# EasyEDA Pro project ProPrj_BLDC_complete_drive_controller_REV2_2026-06-24.epro

# Schematic Schematic1
Board Name: Board1; Create Date: 2026-06-22; Page Name: P1; Project Name: BLDC_complete_drive_controller_REV2; Schematic Name: Schematic1; Update Date: 2026-06-22; Company: EasyEDA.com; Page Size: A4; Version: V1.0
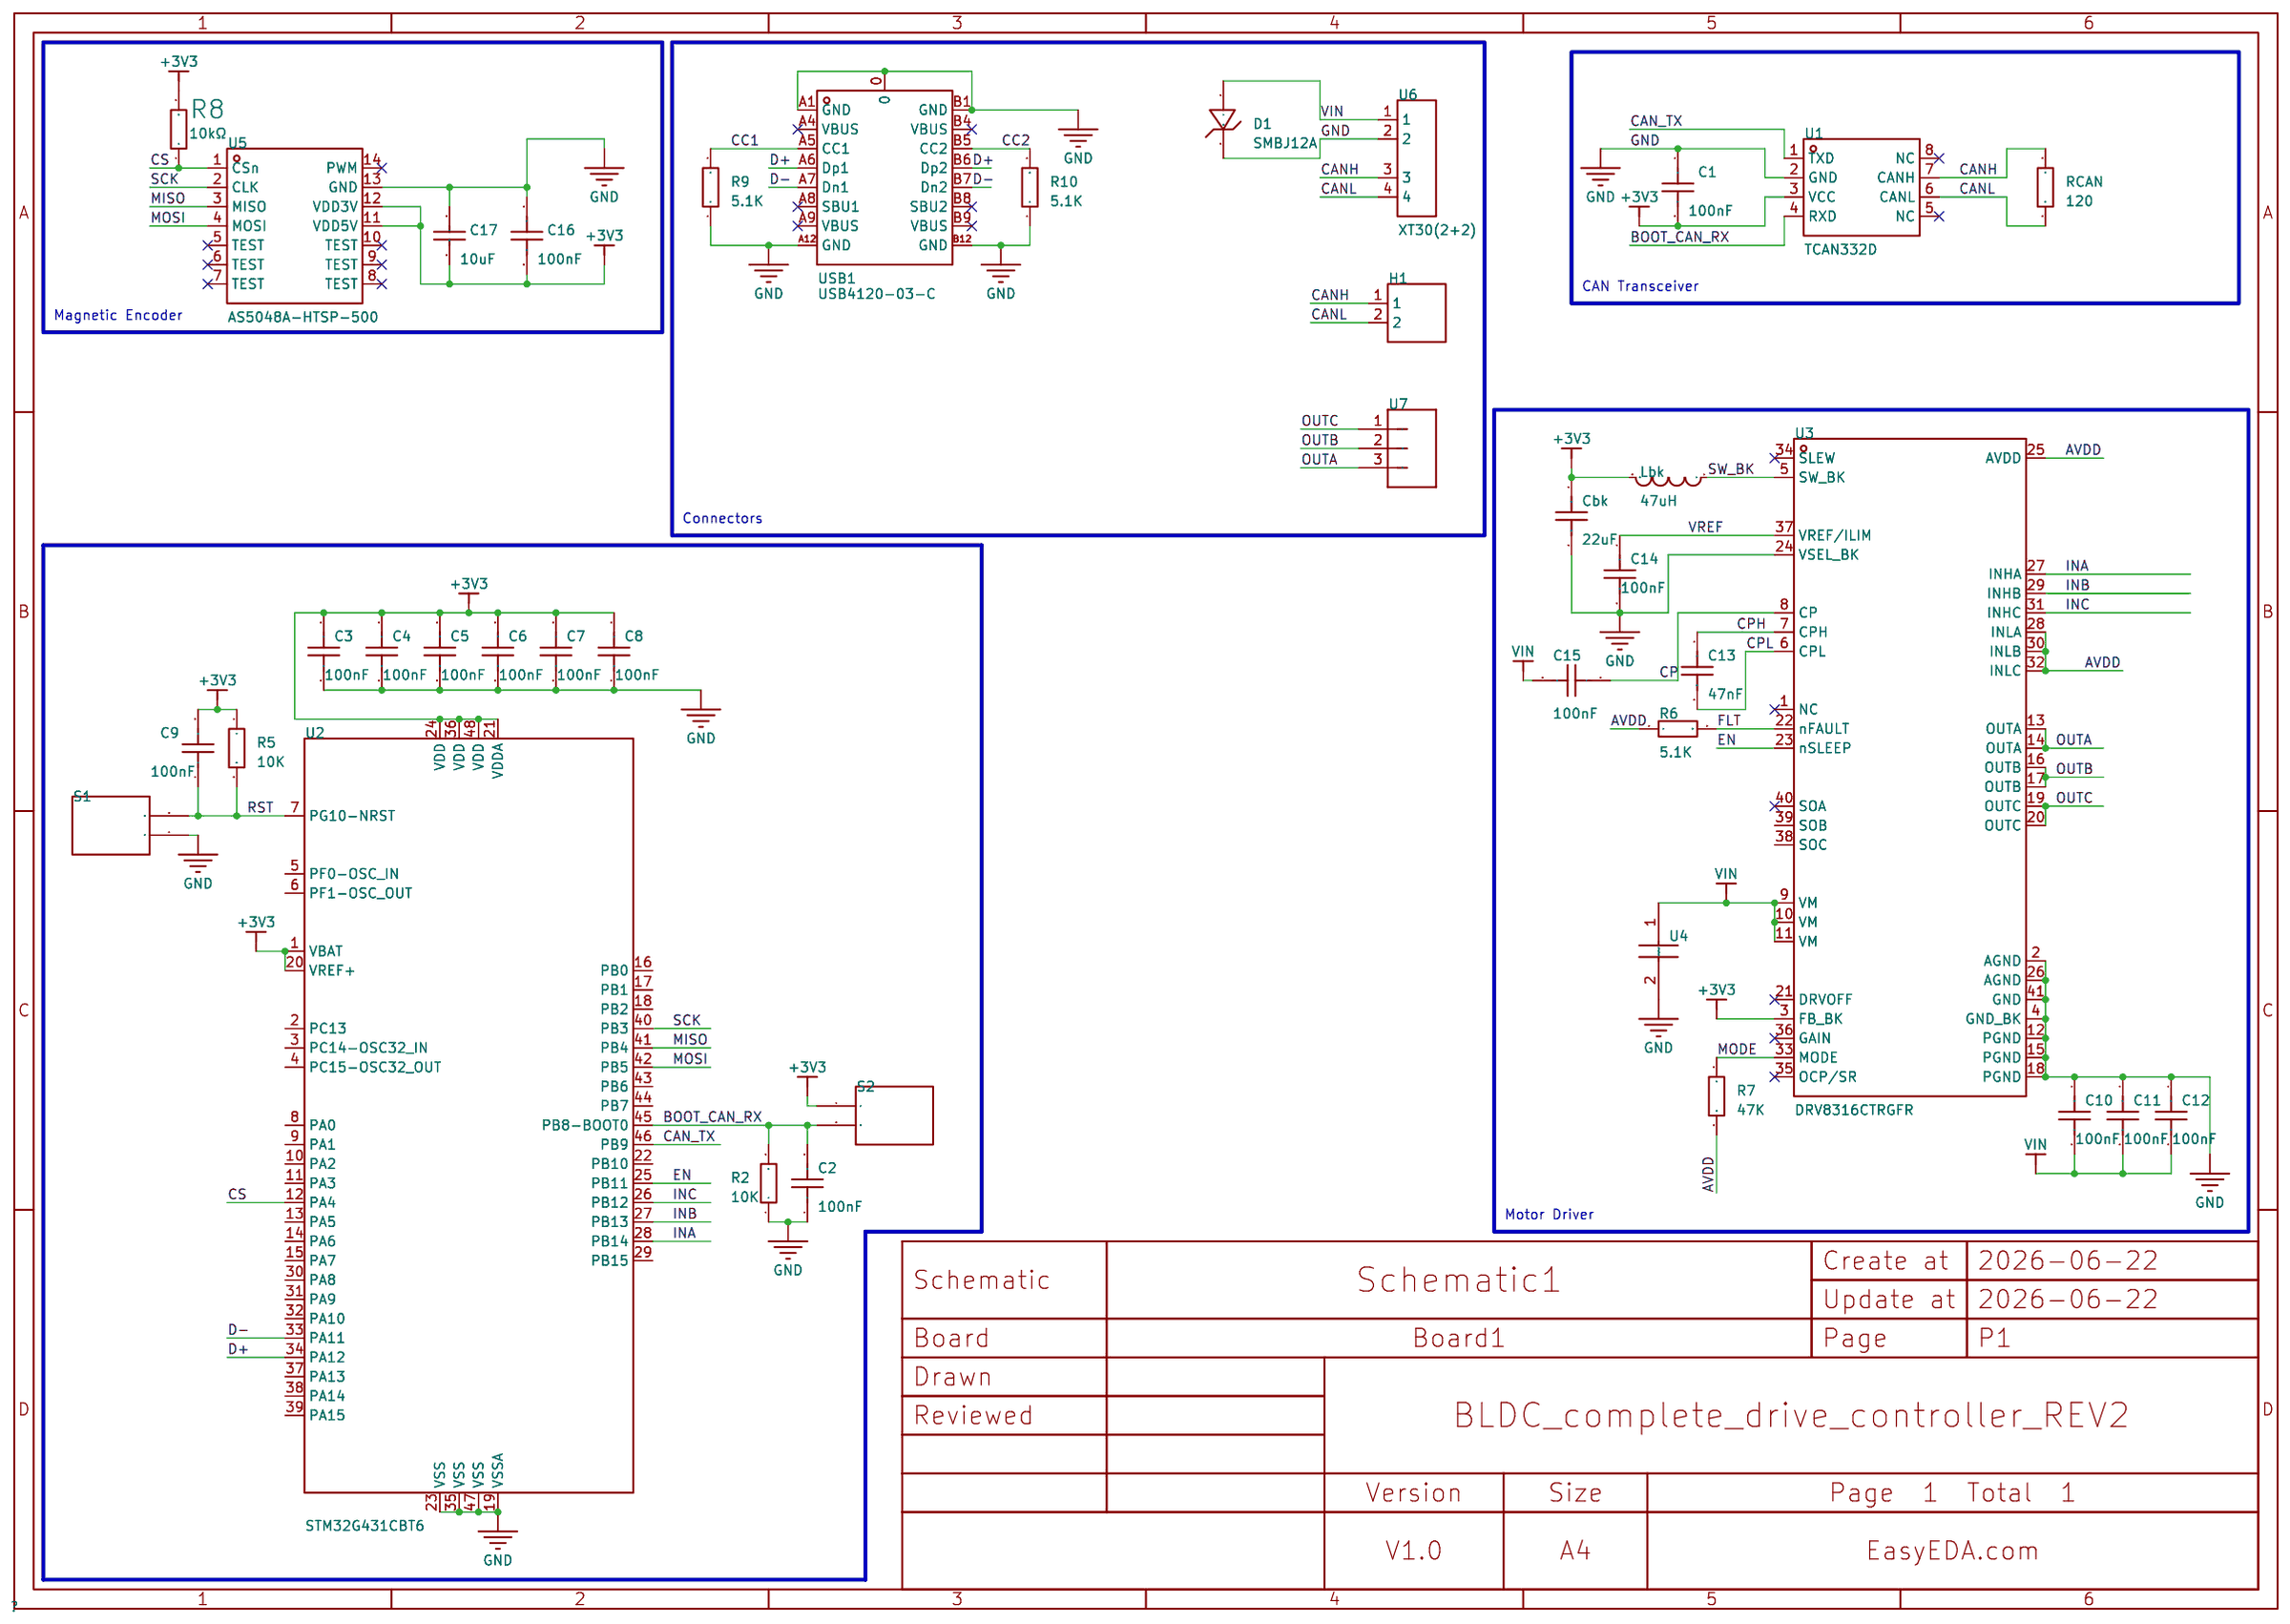
[diagram p0: schematic sheet]

## Parts
C1  100nF  [C0402]
C2  100nF  [C0402]
C3  100nF  [C0402]
C4  100nF  [C0402]
C5  100nF  [C0402]
C6  100nF  [C0402]
C7  100nF  [C0402]
C8  100nF  [C0402]
C9  100nF  [C0402]
C10  100nF  [C0603]
C11  100nF  [C0603]
C12  100nF  [C0603]
C13  47nF  [C0603]
C14  100nF  [C0402]
C15  100nF  [C0603]
C16  100nF  [C0603]
C17  10uF  [C0402]
Cbk  22uF  [C0402]
D1  SMBJ12A  [SMB_L4.6-W3.6-LS5.3-RD]
H1  -  [HDR-TH_2P-P2.54-V-M-1]
Lbk  47uH  [L0805]
R2  10K  [R0603]
R5  10K  [R0603]
R6  5.1K  [R0402]
R7  47K  [R0402]
R8  10kΩ  [R0603]
R9  5.1K  [R0603]
R10  5.1K  [R0603]
RCAN  120  [R0603]
S1  -  [95C04A3GWRT]
S2  -  [95C04A3GWRT]
U1  TCAN332D  [SOIC-8_L4.9-W3.9-P1.27-LS6.0-BL]
U2  STM32G431CBT6  [LQFP-48_L7.0-W7.0-P0.50-LS9.0-BL]
U3  DRV8316CTRGFR  [VQFN-40_L7.0-W5.0-P0.50-TL-EP5.7]
U4  aha0608470m035r  [CAPAE660X850N]
U5  AS5048A-HTSP-500  [TSSOP-14_L5.0-W4.4-P0.65-LS6.4-BL]
U6  XT30(2+2)  [CONN-TH_XT30-2-2]
U7  -  [SCREWTERMINAL-3.5MM-3]
USB1  USB4120-03-C  [TYPE-C-SMD_USB4120-03-C]

## Library data of the parts
C1-C9 C14 Cbk = CAP_0402: Supplier Part: C1525; Supplier Footprint: 0402
C10-C13 C15 = CAP_0603: Supplier Footprint: 0603
C16 = CC0603KRX7R9BB104: Capacitance:100nF Tolerance:±10% Tolerance:±10% Voltage Rating:50V Temperature Coefficient:X7R; LCSC Part Name: 100nF ±10% 50V; Supplier Part: C14663; Manufacturer: YAGEO(国巨); Supplier Footprint: 0603; JLCPCB Part Class: Basic Part; Datasheet: https://item.szlcsc.com/datasheet/CC0603KRX7R9BB104/15331.html; Supplier: LCSC; Tolerance: ±10%; Voltage Rating: 50V; Temperature Coefficient: X7R
C17 = CL05A106MQ5NUNC: Capacitance:10uF Tolerance:±20% Tolerance:±20% Voltage Rating:6.3V Temperature Coefficient:X5R; LCSC Part Name: 10uF ±20% 6.3V; Supplier Part: C15525; Manufacturer: SAMSUNG(三星); Supplier Footprint: 0402; JLCPCB Part Class: Basic Part; Datasheet: https://item.szlcsc.com/datasheet/CL05A106MQ5NUNC/16204.html; Supplier: LCSC; Tolerance: ±20%; Voltage Rating: 6.3V; Temperature Coefficient: X5R
D1 = SMBJ12A: Reverse Stand-Off Voltage (Vrwm):12V Maximum Clamping Voltage:19.9V Peak Pulse Current (Ipp)@10/1000us:30.2A Breakdown Voltage:13.3V Type:TVS; Supplier Part: C127552; Supplier Footprint: SMB(DO-214AA); JLCPCB Part Class: Extended Part; Datasheet: https://atta.szlcsc.com/upload/public/pdf/source/20190828/C415856_91585ADD1001807004044059320FFAFB.pdf; Supplier: LCSC; Reverse Stand-Off Voltage (Vrwm): 12V; Maximum Clamping Voltage: 19.9V; Peak Pulse Current (Ipp)@10/1000us: 30.2A; Breakdown Voltage: 13.3V; Type: TVS
H1 = HDR-M_2.54_1x2P: Supplier Footprint: Through
Lbk = L_0805
R2 R5 R9 R10 RCAN = Res_0603: Supplier Footprint: 0603
R6 R7 = Res_0402: Supplier Footprint: 0402
R8 = 0603WAF1002T5E: Type:Thick Film Resistor Resistance:10kΩ Tolerance:±1% Tolerance:±1% Power(Watts):100mW Voltage-Supply(Max):75V Temperature Coefficient:±100ppm/℃ Temperature Coefficient:±100ppm/℃ Operating Temperature:-55℃~+155℃ Operating Temperature:-55℃~+155℃; LCSC Part Name: 厚膜电阻 10kΩ ±1% 100mW; Supplier Part: C25804; Manufacturer: UNI-ROYAL(厚声); Supplier Footprint: 0603; JLCPCB Part Class: Basic Part; Datasheet: https://item.szlcsc.com/datasheet/0603WAF1002T5E/26547.html; Supplier: LCSC; Type: Thick Film Resistor; Tolerance: ±1%; Power(Watts): 100mW; Voltage-Supply(Max): 75V; Temperature Coefficient: ±100ppm/℃; Operating Temperature: -55℃~+155℃
S1 S2 = 95c04a3gwrt
U1 = TCAN332D: Type:Transceiver Data Rate:1Mbps Supply Voltage:3V~3.6V Supply Voltage:3V~3.6V Operating Temperature:-40℃~+125℃ Operating Temperature:-40℃~+125℃; Supplier Part: C1544505; Manufacturer: TI(德州仪器); Supplier Footprint: SOIC-8; JLCPCB Part Class: Extended Part; Datasheet: https://www.ti.com/cn/lit/gpn/tcan332; Supplier: LCSC; Type: Transceiver; Data Rate: 1Mbps; Supply Voltage: 3V~3.6V; Operating Temperature: -40℃~+125℃
U2 = STM32G431CBT6: CPU Core:ARM Cortex-M Series CPU Maximum Speed:170MHz Program Storage Size:128KB Program Memory Type:FLASH Number of I/O:38 ADC (Bit):12bit DAC (Bit):12bit Voltage - Supply:1.71V~3.6V Voltage - Supply:1.71V~3.6V Applications:-; LCSC Part Name: 带DSP和FPU的170MHz主流ARM Cortex-M4 MCU，具有128 KB Flash存储器、数学加速器和中等模拟电平集成; Supplier Part: C529355; Manufacturer: ST(意法半导体); Supplier Footprint: LQFP-48(7x7); JLCPCB Part Class: Extended Part; Datasheet: https://item.szlcsc.com/datasheet/STM32G431CBT6/549633.html; Supplier: LCSC; CPU Core: ARM Cortex-M Series; CPU Maximum Speed: 170MHz; Program Storage Size: 128KB; Program Memory Type: FLASH; Number of I/O: 38; ADC (Bit): 12bit; DAC (Bit): 12bit; Voltage - Supply: 1.71V~3.6V
U3 = DRV8316CTRGFR: Output Current:8A Output Current:8A Peak Current:8A Voltage - Supply:- Voltage - Supply:- RDS(on):95mΩ Operating Temperature:-40℃~+125℃ Operating Temperature:-40℃~+125℃; LCSC Part Name: DRV8316C 三相集成FET电机驱动器; Supplier Part: C6602057; Manufacturer: TI(德州仪器); Supplier Footprint: VQFN-40(5x7); Datasheet: https://item.szlcsc.com/datasheet/DRV8316CTRGFR/7556994.html; Supplier: LCSC; Output Current: 8A; Peak Current: 8A; RDS(on): 95mΩ; Operating Temperature: -40℃~+125℃
U4 = aha0608470m035r
U5 = AS5048A-HTSP-500: Voltage - Supply:3V~3.6V；4.5V~5.5V Voltage - Supply:3V~3.6V；4.5V~5.5V Rotation Angle:0°~360° Rotation Angle:0°~360°; Supplier Part: C2655181; Manufacturer: ams(艾迈斯半导体); Supplier Footprint: TSSOP-14; JLCPCB Part Class: Extended Part; Datasheet: https://item.szlcsc.com/datasheet/AS5048A-HTSP-500/2747090.html; Supplier: LCSC; Voltage - Supply: 3V~3.6V；4.5V~5.5V; Rotation Angle: 0°~360°
U6 = XT30(2+2): Supplier Part: C9900178769; Supplier Footprint: 插件; Supplier: LCSC
U7 = CONN_03_POS_SCREW_3.5MM
USB1 = USB4120-03-C: Connector Type:Type-C Protocol Standard:USB 2.0 Gender:Female Number of Contacts:24P Number of Ports:1 Current Rating-Power:5A Voltage Rating:48V Detection color:Black Operating Temperature:-25℃~+85℃ Operating Temperature:-25℃~+85℃; LCSC Part Name: Type-C 母; Supplier Part: C3445864; Manufacturer: GCT; Supplier Footprint: SMD; JLCPCB Part Class: Extended Part; Datasheet: https://item.szlcsc.com/datasheet/USB4120-03-C/4011241.html; Supplier: LCSC; Connector Type: Type-C; Protocol Standard: USB 2.0; Gender: Female; Number of Contacts: 24P; Number of Ports: 1; Current Rating-Power: 5A; Voltage Rating: 48V; Detection color: Black; Operating Temperature: -25℃~+85℃

## Nets
+3V3: C1.2 C3.2 C4.2 C5.2 C6.2 C7.2 C8.2 C9.2 C16.2 C17.1 Cbk.1 Lbk.2 R5.1 R8.2 S2.1 U1.3(VCC) U2.1(VBAT) U2.20(VREF+) U2.21(VDDA) U2.24(VDD) U2.36(VDD) U2.48(VDD) U3.3(FB_BK) U5.11(VDD5V) U5.12(VDD3V)
AVDD: R6.1 R7.2 U3.25(AVDD) U3.28(INLA) U3.30(INLB) U3.32(INLC)
GND: C1.1 C2.1 C3.1 C4.1 C5.1 C6.1 C7.1 C8.1 C10.1 C11.1 C12.1 C14.2 C16.1 C17.2 Cbk.2 D1.1(C) R2.1 R9.1 R10.1 S1.1 U1.2(GND) U2.19(VSSA) U2.23(VSS) U2.35(VSS) U2.47(VSS) U3.2(AGND) U3.4(GND_BK) U3.12(PGND) U3.15(PGND) U3.18(PGND) U3.24(VSEL_BK) U3.26(AGND) U3.41(GND) U4.2 U5.13(GND) U6.2 USB1.0 USB1.A1(GND) USB1.A12(GND) USB1.B1(GND) USB1.B12(GND)
VIN: C10.2 C11.2 C12.2 C15.2 D1.2(A) U3.9(VM) U3.10(VM) U3.11(VM) U4.1 U6.1
BOOT_CAN_RX: C2.2 R2.2 S2.2 U1.4(RXD) U2.45(PB8-BOOT0)
CAN_TX: U1.1(TXD) U2.46(PB9)
CANH: H1.1 RCAN.2 U1.7(CANH) U6.3
CANL: H1.2 RCAN.1 U1.6(CANL) U6.4
CC1: R9.2 USB1.A5(CC1)
CC2: R10.2 USB1.B5(CC2)
CP: C15.1 U3.8(CP)
CPH: C13.1 U3.7(CPH)
CPL: C13.2 U3.6(CPL)
CS: R8.1 U2.12(PA4) U5.1(CSn)
D+: U2.34(PA12) USB1.A6(Dp1) USB1.B6(Dp2)
D-: U2.33(PA11) USB1.A7(Dn1) USB1.B7(Dn2)
EN: U2.25(PB11) U3.23(nSLEEP)
FLT: R6.2 U3.22(nFAULT)
INA: U2.28(PB14) U3.27(INHA)
INB: U2.27(PB13) U3.29(INHB)
INC: U2.26(PB12) U3.31(INHC)
MISO: U2.41(PB4) U5.3(MISO)
MODE: R7.1 U3.33(MODE)
MOSI: U2.42(PB5) U5.4(MOSI)
OUTA: U3.13(OUTA) U3.14(OUTA) U7.3
OUTB: U3.16(OUTB) U3.17(OUTB) U7.2
OUTC: U3.19(OUTC) U3.20(OUTC) U7.1
RST: C9.1 R5.2 S1.2 U2.7(PG10-NRST)
SCK: U2.40(PB3) U5.2(CLK)
SW_BK: Lbk.1 U3.5(SW_BK)
VREF: C14.1 U3.37(VREF/ILIM)

Not connected (* = marked no-connect by the designer): U1 5(NC)* 8(NC)*; U2 2(PC13) 3(PC14-OSC32_IN) 4(PC15-OSC32_OUT) 5(PF0-OSC_IN) 6(PF1-OSC_OUT) 8(PA0) 9(PA1) 10(PA2) 11(PA3) 13(PA5) 14(PA6) 15(PA7) 16(PB0) 17(PB1) 18(PB2) 22(PB10) 29(PB15) 30(PA8) 31(PA9) 32(PA10) 37(PA13) 38(PA14) 39(PA15) 43(PB6) 44(PB7); U3 1(NC)* 21(DRVOFF)* 34(SLEW)* 35(OCP/SR)* 36(GAIN)* 38(SOC) 39(SOB) 40(SOA)*; U5 5(TEST)* 6(TEST)* 7(TEST)* 8(TEST)* 9(TEST)* 10(TEST)* 14(PWM)*; USB1 A4(VBUS)* A8(SBU1)* A9(VBUS)* B4(VBUS)* B8(SBU2)* B9(VBUS)*

## Notes on the sheet
- CAN Transceiver
- Magnetic Encoder
- Connectors
- Motor Driver

# Board PCB1
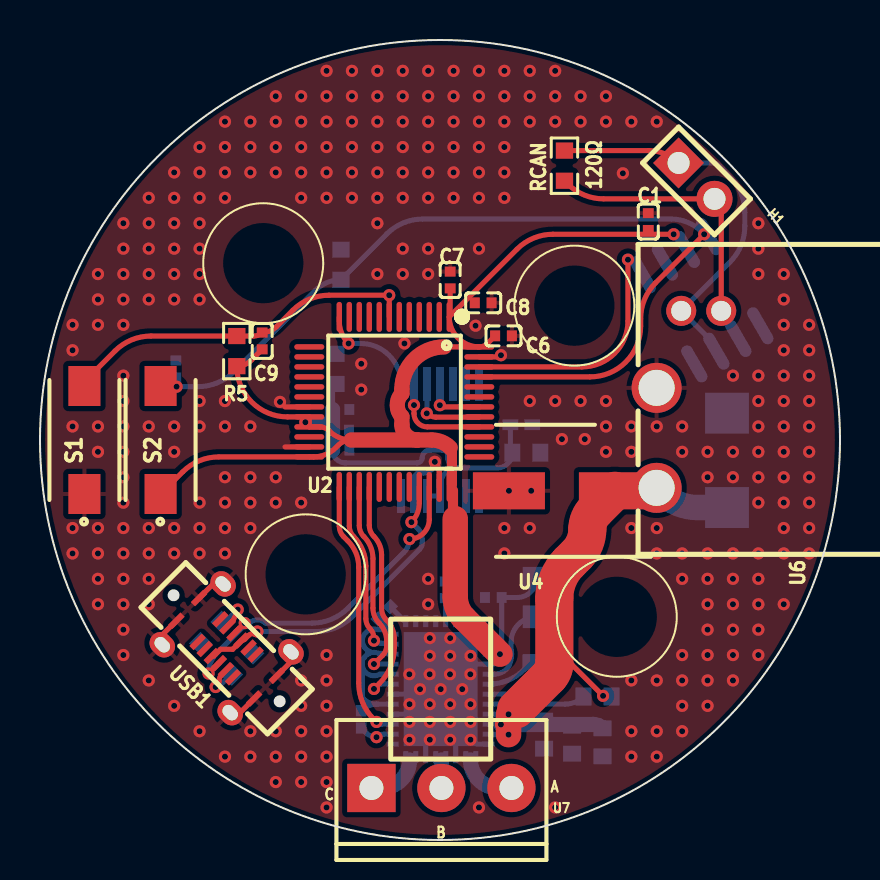
[diagram p1: board, top side]
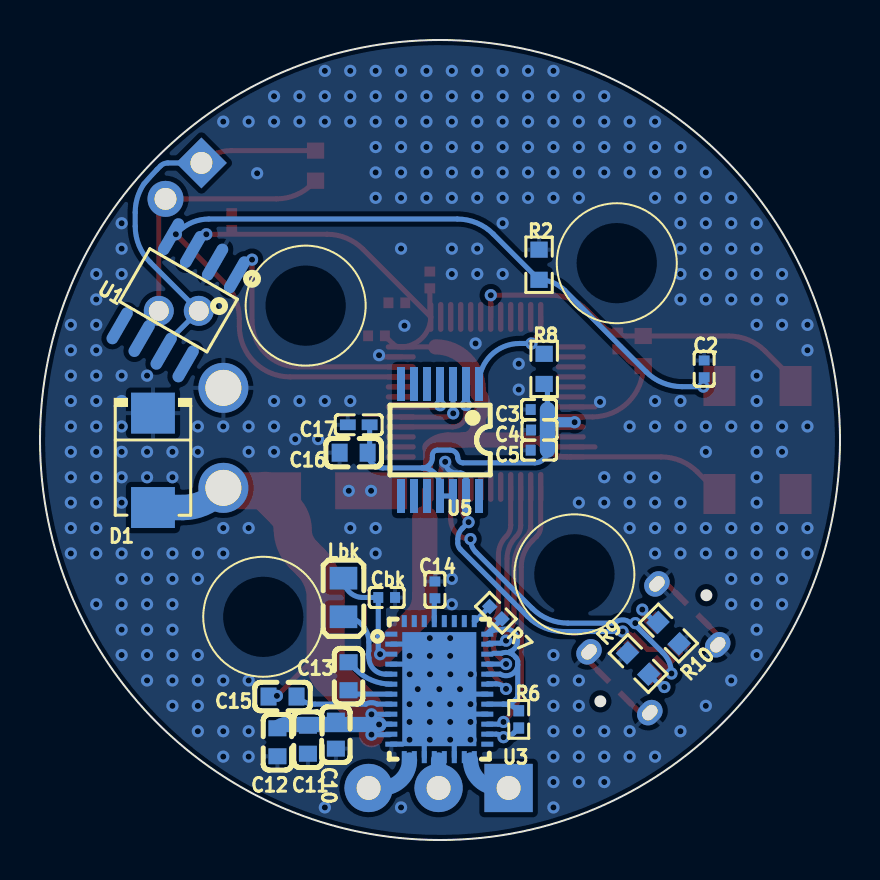
[diagram p2: board, bottom side, seen from below]

Outline 40 x 40 mm; copper layers: Top Layer, Bottom Layer. Coordinates in mm from the lower left corner of the outline.
Outline path: circle c20,20 r20
Stack: Top Layer 0.035mm / Dielectric1 1.51mm FR4 er 4.5 / Bottom Layer 0.035mm

## Design rules (mm)
spacing copperThickness1oz (default): track to track 0.102, other pairs 0.152 to 0.3
spacing copperThickness2oz: track to track 0.203, other pairs 0.152 to 0.3
track width copperThickness1oz (default): min 0.127, default 0.254, max 2.54
track width copperThickness2oz: min 0.203, default 0.254, max 2.54
differential pair differentialPair (default): width min 0.127, default 0.254, max 2.54; gap min 0.152, default 0.152
net GND uses copperRegion

## Placement (name value [footprint] x y rotation side)
C1  100nF  [C0402]  30.41 30.92 270 top
C2  100nF  [C0402]  6.79 23.56 270 bottom
C3  100nF  [C0402]  15.05 21.52 180 bottom
C4  100nF  [C0402]  15.03 20.5 180 bottom
C5  100nF  [C0402]  15.05 19.49 180 bottom
C6  100nF  [C0402]  23.18 25.21 180 top
C7  100nF  [C0402]  20.51 28 270 top
C8  100nF  [C0402]  22.16 26.86 180 top
C9  100nF  [C0402]  11.11 24.95 270 top
C10  100nF  [C0603]  25.21 5.27 90 bottom
C11  100nF  [C0603]  26.6 5.01 90 bottom
C12  100nF  [C0603]  28.13 4.89 90 bottom
C13  47nF  [C0603]  24.57 8.19 90 bottom
C14  100nF  [C0402]  20.25 12.51 90 bottom
C15  100nF  [C0603]  27.87 7.17 0 bottom
C16  100nF  [C0603]  24.32 19.36 180 bottom
C17  10uF  [C0402#2]  24.06 20.76 0 bottom
Cbk  22uF  [C0402]  22.67 12.13 180 bottom
D1  SMBJ12A  [SMB_L4.6-W3.6-LS5.3-RD]  34.35 18.98 270 bottom
H1  -  [HDR-TH_2P-P2.54-V-M-1]  32.83 32.95 315 top
Lbk  47uH  [L0805]  24.83 12.13 90 bottom
R2  10K  [R0603]  15.05 28.76 270 bottom
R5  10K  [R0603]  9.84 24.44 90 top
R6  5.1K  [R0402]  16.06 6.03 270 bottom
R7  47K  [R0402]  17.21 11.36 225 bottom
R8  10kΩ  [R0603]  14.79 23.56 270 bottom
R9  5.1K  [R0603]  10.09 8.82 225 bottom
R10  5.1K  [R0603]  8.57 10.35 45 bottom
RCAN  120  [R0603]  26.22 33.72 90 top
S1  -  [95C04A3GWRT]  2.22 20 90 top
S2  -  [95C04A3GWRT]  6.03 20 90 top
U1  TCAN332D  [SOIC-8_L4.9-W3.9-P1.27-LS6.0-BL]  33.08 26.98 30 bottom
U2  STM32G431CBT6  [LQFP-48_L7.0-W7.0-P0.50-LS9.0-BL]  17.71 21.91 180 top
U3  DRV8316CTRGFR  [VQFN-40_L7.0-W5.0-P0.50-TL-EP5.7]  20.04 7.54 180 bottom
U4  aha0608470m035r  [CAPAE660X850N]  26.1 17.46 180 top
U5  AS5048A-HTSP-500  [TSSOP-14_L5.0-W4.4-P0.65-LS6.4-BL]  20 20 0 bottom
U6  XT30(2+2)  [CONN-TH_XT30-2-2]  32.45 22.03 90 top
U7  -  [SCREWTERMINAL-3.5MM-3]  16.57 2.6 0 top
USB1  USB4120-03-C  [TYPE-C-SMD_USB4120-03-C]  9.33 9.59 135 top

## Footprints (pads in the part's own frame, mm; a bottom-side part is the same pattern mirrored in y, then rotated)
95C04A3GWRT
  rect 2x1.6 smd: 1(-2.7,0) 2(2.7,0)
C0402
  rect 0.5x0.54 smd: 1(-0.42,0) 2(0.42,0)
C0402#2
  rect 0.79x0.54 smd: 1(-0.545,0) 2(0.545,0)
C0603
  rect 0.8x0.9 smd: 1(-0.7,0) 2(0.7,0)
CAPAE660X850N
  rect 3.6x1.85 smd: 1(-2.65,0) 2(2.65,0)
CONN-TH_XT30-2-2
  round 2.5 hole 1.8: 1(-4.425,1.615) 2(0.575,1.615)
  round 1.5 hole 1: 3(4.425,0.385) 4(4.425,-1.615)
HDR-TH_2P-P2.54-V-M-1
  rect 1.8x1.8 hole 1.1: 1(-1.27,0)
  round 1.8 hole 1.1: 2(1.27,0)
L0805
  rect 1.133x1.377 smd: 1(-0.966,0) 2(0.966,0)
LQFP-48_L7.0-W7.0-P0.50-LS9.0-BL
  oval 0.27x1.5 smd: 1(-2.75,-4.25) 2(-2.25,-4.25) 3(-1.75,-4.25) 4(-1.25,-4.25) 5(-0.75,-4.25) 6(-0.25,-4.25) 7(0.25,-4.25) 8(0.75,-4.25) 9(1.25,-4.25) 10(1.75,-4.25) 11(2.25,-4.25) 12(2.75,-4.25) 25(2.75,4.25) 26(2.25,4.25) 27(1.75,4.25) 28(1.25,4.25) 29(0.75,4.25) 30(0.25,4.25) 31(-0.25,4.25) 32(-0.75,4.25) 33(-1.25,4.25) 34(-1.75,4.25) 35(-2.25,4.25) 36(-2.75,4.25)
  oval 1.5x0.27 smd: 13(4.25,-2.75) 14(4.25,-2.25) 15(4.25,-1.75) 16(4.25,-1.25) 17(4.25,-0.75) 18(4.25,-0.25) 19(4.25,0.25) 20(4.25,0.75) 21(4.25,1.25) 22(4.25,1.75) 23(4.25,2.25) 24(4.25,2.75) 37(-4.25,2.75) 38(-4.25,2.25) 39(-4.25,1.75) 40(-4.25,1.25) 41(-4.25,0.75) 42(-4.25,0.25) 43(-4.25,-0.25) 44(-4.25,-0.75) 45(-4.25,-1.25) 46(-4.25,-1.75) 47(-4.25,-2.25) 48(-4.25,-2.75)
R0402
  rect 0.566x0.54 smd: 1(-0.433,0) 2(0.433,0)
R0603
  rect 0.806x0.864 smd: 1(-0.753,0) 2(0.753,0)
SCREWTERMINAL-3.5MM-3
  rect 2.413x2.413 hole 1.2: 1(0,0)
  round 2.413 hole 1.2: 2(3.5,0) 3(7,0)
SMB_L4.6-W3.6-LS5.3-RD
  rect 2.047x2.192 smd: 1(-2.361,0) 2(2.361,0)
SOIC-8_L4.9-W3.9-P1.27-LS6.0-BL
  oval 0.588x2.045 smd: 1(-1.905,-2.57) 2(-0.635,-2.57) 3(0.635,-2.57) 4(1.905,-2.57) 5(1.905,2.57) 6(0.635,2.57) 7(-0.635,2.57) 8(-1.905,2.57)
TSSOP-14_L5.0-W4.4-P0.65-LS6.4-BL
  rect 0.4x1.7 smd: 1(-1.95,-2.8) 2(-1.3,-2.8) 3(-0.65,-2.8) 4(0,-2.8) 5(0.65,-2.8) 6(1.3,-2.8) 7(1.95,-2.8) 8(1.95,2.8) 9(1.3,2.8) 10(0.65,2.8) 11(0,2.8) 12(-0.65,2.8) 13(-1.3,2.8) 14(-1.95,2.8)
TYPE-C-SMD_USB4120-03-C
  oval 1.35x1.1 hole 0.85x0.6: 0(-2.4,2.15) 0(-2.4,-2.15) 0(2.4,2.15) 0(2.4,-2.15)
  rect 0.3x0.87 smd: A1(-2.75,0.8) A4(-1.25,0.8) A5(-0.75,0.8) A6(-0.25,0.8) A7(0.25,0.8) A8(0.75,0.8) A9(1.25,0.8) A12(2.75,0.8) B1(2.75,-0.8) B4(1.25,-0.8) B5(0.75,-0.8) B6(0.25,-0.8) B7(-0.25,-0.8) B8(-0.75,-0.8) B9(-1.25,-0.8) B12(-2.75,-0.8)
VQFN-40_L7.0-W5.0-P0.50-TL-EP5.7
  rect 0.6x0.25 smd: 1(-2.4,2.75) 2(-2.4,2.25) 3(-2.4,1.75) 4(-2.4,1.25) 5(-2.4,0.75) 6(-2.4,0.25) 7(-2.4,-0.25) 8(-2.4,-0.75) 9(-2.4,-1.25) 10(-2.4,-1.75) 11(-2.4,-2.25) 12(-2.4,-2.75) 21(2.4,-2.75) 22(2.4,-2.25) 23(2.4,-1.75) 24(2.4,-1.25) 25(2.4,-0.75) 26(2.4,-0.25) 27(2.4,0.25) 28(2.4,0.75) 29(2.4,1.25) 30(2.4,1.75) 31(2.4,2.25) 32(2.4,2.75)
  rect 0.25x0.6 smd: 13(-1.75,-3.4) 14(-1.25,-3.4) 15(-0.75,-3.4) 16(-0.25,-3.4) 17(0.25,-3.4) 18(0.75,-3.4) 19(1.25,-3.4) 20(1.75,-3.4) 33(1.75,3.4) 34(1.25,3.4) 35(0.75,3.4) 36(0.25,3.4) 37(-0.25,3.4) 38(-0.75,3.4) 39(-1.25,3.4) 40(-1.75,3.4)
  rect 3.7x5.7 smd: 41(0,0)

## Nets
As in the schematic.

Pads without a net: U1 5 8; U2 2 3 4 5 6 8 9 10 11 13 14 15 16 17 18 22 29 30 31 32 37 38 39 43 44; U3 1 21 34 35 36 38 39 40; U5 5 6 7 8 9 10 14; USB1 A4 A8 A9 B4 B8 B9

## Via types
v1: diameter 0.61, hole 0.305, Top Layer to Bottom Layer, 331 vias

## Routing (per net, layer and track width the routed paths; a pad name or vN(x,y) marks a point on that pad's centre or on a via; arc(x,y) is an arc through that point)
+3V3: length 86.2
  Top Layer w0.254: C9.2 10.57,24 arc(10.24,23.77) R5.1 arc(10.58,21.9) 12.38,21.16 U2.20 U2.21 13.98,20.66 arc(14.24,20.6) 14.46,20.45 arc(14.97,20.12) 15.56,20 arc(15.2,19.93) 14.9,19.73 14.79,19.62 arc(14.28,19.28) 13.67,19.16 U2.24 8.94,19.16 arc(7.97,18.96) 7.14,18.41 S2.1 ; U2.1 23.85,29.54 arc(24.68,30.09) 25.65,30.29 v1(31.68,30.29) ; U2.1 arc(20.9,25.09) U2.48 ; U2.1 arc(20.5,26.2) 20.51,26.26 C7.2 ; C6.2 22.37,24.82 arc(22.18,24.7) U2.48 ; U2.48 20.21,24.66
  Top Layer w0.508: 20.6,17.79 20.6,19.38 20.46,19.51 arc(20.48,19.57) 20.51,19.62 ; 20.65,17.47 20.65,16.26
  Top Layer w0.762: 18.86,20 15.56,20 ; 18.86,20 19.59,20 arc(20.09,19.9) 20.51,19.62 ; 18.86,20 arc(18.32,20.22) 18.09,20.76 18.09,21.17 arc(17.86,21.75) 18.09,22.33 18.09,22.54 arc(18.71,24.04) 20.21,24.66
  Top Layer w1.27: 20.76,16.06 20.76,12.16 arc(20.88,11.57) 21.21,11.08 v1(23,9.29)
  Bottom Layer w0.254: C3.2 14.63,22.4 arc(14.67,22.62) R8.2 ; U5.12 U5.11 20,17.71 arc(20.26,18.34) 20.89,18.6 ; 20.89,18.6 22.86,18.6 arc(23.39,18.83) C16.2 arc(23.55,19.39) 23.52,19.46 C17.1 ; 20.89,18.6 arc(20.53,18.75) 20.38,19.11 20.38,19.24 arc(20.31,19.42) 20.13,19.49 19.49,19.49 arc(19.22,19.38) 19.11,19.11 arc(19.04,18.93) 18.86,18.86 15.26,18.86 arc(14.81,19.04) C5.2 ; v1(23,9.29) arc(23.06,9.32) 23.09,9.38 Cbk.1 23.86,12.13 arc(24.54,12.41) Lbk.2
  Bottom Layer w0.508: v1(13.27,20.89) 14.22,20.89 arc(14.49,20.77) C4.2
  Bottom Layer w0.762: C5.2 C3.2
AVDD: length 11.5
  Bottom Layer w0.254: 17.33,9.33 16.93,9.33 arc(16.7,9.38) 16.46,9.33 arc(16.42,9.32) 16.39,9.3 ; U3.28 16.99,8.29 arc(16.42,8.29) 16.11,8.77 ; 16.39,9.3 16.37,9.28 arc(16.28,9.21) 16.22,9.13 16.19,9.1 arc(16.13,9.02) 16.11,8.92 16.11,8.77 ; 16.39,9.3 16.5,9.42 arc(16.15,10.16) 16.89,10.52 17.09,10.52 arc(17.39,10.46) U3.32 arc(17.63,10.32) 17.61,10.34 R7.2 ; 16.86,6.79 U3.25 ; 16.86,6.79 16.8,6.79 arc(16.47,6.86) 16.19,7.05 arc(16.13,7.13) 16.11,7.23 16.11,8.77 ; 16.86,6.79 arc(16.43,6.71) R6.1
GND: length 17.1
  Top Layer w0.254: USB1.A12 6.11,10.26 6.11,9.76 ; USB1.0 8.66,12.8 7.95,12.1 ; U2.23 12.25,19.66 ; 12.55,9.41 12.55,8.91 USB1.B12 ; U2.35 19.96,18.37 arc(19.91,18.66) v1(19.74,18.91) ; USB1.0 10,6.37 10.71,7.08 ; U2.47 22.84,24.16 arc(22.95,24.18) v1(23.05,24.24) ; U2.19 12.25,21.66
  Bottom Layer w0.254: U3.4 21.88,8.79 ; U3.15 20.79,4.7 ; U3.18 19.29,4.7 ; U3.26 18.19,7.29 ; U3.24 18.19,6.29 ; U3.2 21.88,9.79 ; U5.13 18.7,18.06 arc(18.78,18.27) 18.98,18.35 19.18,18.35 arc(19.58,18.51) v1(19.74,18.91) ; U3.12 21.88,4.79
  vias: v1(1.63,25.76) v1(1.63,24.49) v1(1.63,20.68) v1(1.63,15.6) v1(1.63,14.33) v1(2.9,28.3) v1(2.9,27.03) v1(2.9,25.76) v1(2.9,20.68) v1(2.9,19.41) v1(2.9,15.6) v1(2.9,14.33) v1(2.9,13.06) v1(2.9,11.79) v1(4.17,30.84) v1(4.17,29.57) v1(4.17,28.3) v1(4.17,27.03) v1(4.17,25.76) v1(4.17,23.22) v1(4.17,21.95) v1(4.17,20.68) v1(4.17,19.41) v1(4.17,18.14) v1(4.17,16.87) v1(4.17,15.6) v1(4.17,14.33) v1(4.17,13.06) v1(4.17,11.79) v1(4.17,10.52) v1(4.17,9.25) v1(5.44,32.11) v1(5.44,30.84) v1(5.44,29.57) v1(5.44,28.3) v1(5.44,27.03) v1(5.44,20.68) v1(5.44,15.6) v1(5.44,14.33) v1(5.44,13.06) v1(5.44,11.79) v1(5.44,7.98) v1(6.71,33.38) v1(6.71,32.11) v1(6.71,30.84) v1(6.71,29.57) v1(6.71,28.3) v1(6.71,27.03) v1(6.71,20.68) v1(6.71,19.41) v1(6.71,15.6) v1(6.71,14.33) v1(6.71,6.71) v1(7.98,34.65) v1(7.98,33.38) v1(7.98,32.11) v1(7.98,30.84) v1(7.98,29.57) v1(7.98,28.3) v1(7.98,27.03) v1(7.98,21.95) v1(7.98,20.68) v1(7.98,16.87) v1(7.98,15.6) v1(7.98,14.33) v1(7.98,5.44) v1(9.25,35.92) v1(9.25,34.65) v1(9.25,33.38) v1(9.25,32.11) v1(9.25,21.95) v1(9.25,20.68) v1(9.25,18.14) v1(9.25,16.87) v1(9.25,15.6) v1(9.25,14.33) v1(9.25,4.17) v1(10.52,35.92) v1(10.52,34.65) v1(10.52,33.38) v1(10.52,20.68) v1(10.52,18.14) v1(10.52,16.87) v1(10.52,15.6) v1(10.52,5.44) v1(10.52,4.17) v1(11.79,37.19) v1(11.79,35.92) v1(11.79,34.65) v1(11.79,33.38) v1(11.79,18.14) v1(11.79,16.87) v1(11.79,5.44) v1(11.79,4.17) v1(11.79,2.9) v1(12,21.91) v1(13.06,37.19) v1(13.06,35.92) v1(13.06,34.65) v1(13.06,33.38) v1(13.06,32.11) v1(13.06,16.87) v1(13.06,7.98) v1(13.06,6.71) v1(13.06,5.44) v1(13.06,4.17) v1(13.06,2.9) v1(14.33,38.46) v1(14.33,37.19) v1(14.33,35.92) v1(14.33,34.65) v1(14.33,33.38) v1(14.33,32.11) v1(14.33,9.25) v1(14.33,7.98) v1(14.33,6.71) v1(14.33,5.44) v1(14.33,4.17) v1(14.33,2.9) v1(14.33,1.63) v1(15.6,38.46) v1(15.6,37.19) v1(15.6,35.92) v1(15.6,34.65) v1(15.6,33.38) v1(15.6,32.11) v1(16.06,23.81) v1(16.06,22.52) v1(16.87,38.46) v1(16.87,37.19) v1(16.87,35.92) v1(16.87,34.65) v1(16.87,33.38) v1(16.87,32.11) v1(16.87,30.84) v1(16.87,28.3) v1(18.14,38.46) v1(18.14,37.19) v1(18.14,35.92) v1(18.14,34.65) v1(18.14,33.38) v1(18.14,32.11) v1(18.14,29.57) v1(18.14,28.3) v1(18.22,24.83) v1(18.47,8.29) v1(18.48,6.79) v1(18.48,5.9) v1(18.48,5.01) v1(19,7.54) v1(19.41,38.46) v1(19.41,37.19) v1(19.41,35.92) v1(19.41,34.65) v1(19.41,33.38) v1(19.41,32.11) v1(19.41,29.57) v1(19.41,28.3) v1(19.41,13.06) v1(19.41,11.79) v1(19.49,10.09) v1(19.49,9.2) v1(19.48,8.29) v1(19.49,6.79) v1(19.49,5.9) v1(19.49,5.01) v1(20.04,7.54) v1(20.51,10.09) v1(20.51,9.2) v1(20.5,8.29) v1(20.51,6.79) v1(20.51,5.9) v1(20.51,5.01) v1(20.68,38.46) v1(20.68,37.19) v1(20.68,35.92) v1(20.68,34.65) v1(20.68,33.38) v1(20.68,32.11) v1(21.11,7.54) v1(21.52,9.2) v1(21.52,8.29) v1(21.52,6.79) v1(21.52,5.9) v1(21.52,5.01) v1(21.78,25.72) v1(21.95,38.46) v1(21.95,37.19) v1(21.95,35.92) v1(21.95,34.65) v1(21.95,33.38) v1(21.95,32.11) v1(21.95,29.57) v1(21.95,1.63) v1(23.22,38.46) v1(23.22,37.19) v1(23.22,35.92) v1(23.22,34.65) v1(23.22,33.38) v1(23.22,32.11) v1(23.22,15.6) v1(23.22,14.33) v1(23.45,17.46) v1(24.49,38.46) v1(24.49,37.19) v1(24.49,35.92) v1(24.49,21.95) v1(24.49,15.6) v1(24.56,17.46) v1(25.76,38.46) v1(25.76,37.19) v1(25.76,35.92) v1(25.76,21.95) v1(25.76,1.63) v1(26.1,20.04) v1(27.03,37.19) v1(27.03,35.92) v1(27.03,21.95) v1(27.24,20.04) v1(28.3,37.19) v1(28.3,35.92) v1(28.3,21.95) v1(28.3,20.68) v1(28.3,19.41) v1(29.14,33.33) v1(29.57,35.92) v1(29.57,20.68) v1(29.57,19.41) v1(29.57,15.6) v1(29.57,7.98) v1(29.57,5.44) v1(29.57,4.17) v1(30.84,35.92) v1(30.84,20.68) v1(30.84,15.6) v1(30.84,14.33) v1(30.84,7.98) v1(30.84,5.44) v1(30.84,4.17) v1(32.11,20.68) v1(32.11,19.41) v1(32.11,14.33) v1(32.11,13.06) v1(32.11,9.25) v1(32.11,7.98) v1(32.11,6.71) v1(32.11,5.44) v1(33.38,19.41) v1(33.38,18.14) v1(33.38,14.33) v1(33.38,13.06) v1(33.38,11.79) v1(33.38,10.52) v1(33.38,9.25) v1(33.38,7.98) v1(33.38,6.71) v1(34.65,23.22) v1(34.65,19.41) v1(34.65,18.14) v1(34.65,14.33) v1(34.65,13.06) v1(34.65,11.79) v1(34.65,10.52) v1(34.65,9.25) v1(34.65,7.98) v1(35.92,30.84) v1(35.92,29.57) v1(35.92,28.3) v1(35.92,23.22) v1(35.92,21.95) v1(35.92,20.68) v1(35.92,19.41) v1(35.92,18.14) v1(35.92,16.87) v1(35.92,14.33) v1(35.92,13.06) v1(35.92,11.79) v1(35.92,10.52) v1(35.92,9.25) v1(37.19,28.3) v1(37.19,27.03) v1(37.19,25.76) v1(37.19,24.49) v1(37.19,23.22) v1(37.19,21.95) v1(37.19,20.68) v1(37.19,19.41) v1(37.19,18.14) v1(37.19,16.87) v1(37.19,15.6) v1(37.19,14.33) v1(37.19,11.79) v1(38.46,25.76) v1(38.46,24.49) v1(38.46,23.22) v1(38.46,21.95) v1(38.46,20.68) v1(38.46,19.41) v1(38.46,18.14) v1(38.46,16.87) v1(38.46,15.6) v1(38.46,14.33)
VIN: length 28.7
  Top Layer w0.254: v1(28.15,7.21) 26.62,8.74 arc(26.23,9.32) 26.1,10.01
  Top Layer w1.27: v1(23.43,5.27) v1(23.43,6.28)
  Top Layer w1.905: U4.1 27.75,16.46 arc(27.47,16.04) 27.37,15.54 arc(27.23,14.85) 26.84,14.27 26.46,13.89 arc(25.91,13.06) 25.72,12.09 25.72,8.82 arc(25.64,8.47) 25.45,8.17 23.81,6.54
  Bottom Layer w0.254: v1(23.43,5.27) 22.5,5.27 ; v1(23.43,6.28) 22.51,6.28 ; U3.10 23.01,5.79 arc(23.03,5.79) v1(23.05,5.78)
  Bottom Layer w0.762: v1(23.05,5.78) 27.67,5.78 arc(27.92,5.73) C12.2
  Bottom Layer w1.27: U6.1 31.07,17.37 arc(31.89,16.82) 32.87,16.62 D1.2
BOOT_CAN_RX: length 45.1
  Top Layer w0.254: v1(33.21,30.29) 30.78,27.86 arc(30.23,27.03) 30.03,26.06 30.03,25.69 arc(29.29,23.9) 27.49,23.16 U2.45
  Bottom Layer w0.254: v1(33.21,30.29) 33.07,30.42 arc(32.38,30.89) 31.56,31.05 19.14,31.05 arc(18.17,30.86) 17.34,30.31 R2.2 arc(14.35,27.87) 13.76,27.48 9.69,23.41 arc(8.87,22.86) 7.9,22.67 v1(6.83,22.67)
CAN_TX: length 11.8
  Top Layer w0.254: U2.46 27.1,23.66 arc(28.73,24.33) 29.4,25.95 v1(29.4,29.02)
CANH: length 19.6
  Top Layer w0.254: RCAN.2 30.44,34.47 arc(31.25,34.31) H1.1
  Bottom Layer w0.254: U1.7 33.82,24.7 U6.3 34.5,28.89 arc(35.05,29.72) 35.24,30.69 35.24,31.38 arc(35.13,32.13) 34.8,32.8 arc(34.48,33.17) 34.15,33.52 33.97,33.7 arc(33.81,33.81) 33.61,33.85 H1.1
CANL: length 13.5
  Top Layer w0.254: U6.4 34.06,31.24 arc(33.97,31.68) 33.72,32.06 28.18,32.06 arc(27.21,32.25) 26.39,32.8 RCAN.1
CC1: length 2.1
  Top Layer w0.254: USB1.A5 9.1,8.29 arc(8.99,8.13) 8.95,7.94 arc(8.93,7.83) 8.87,7.74 v1(8.78,7.65)
  Bottom Layer w0.254: R9.2 9.02,7.75 arc(8.91,7.68) v1(8.78,7.65)
CC2: length 2.1
  Top Layer w0.254: v1(9.89,11.52) 9.89,11.31 arc(9.75,11.17) 9.67,10.98 USB1.B5
  Bottom Layer w0.254: v1(9.89,11.52) 9.35,10.98 arc(9.24,10.91) R10.2
CP: length 4.9
  Bottom Layer w0.254: U3.8 23.14,6.79 arc(23.43,6.87) 23.71,6.79 26.25,6.79 arc(26.75,6.89) C15.1
CPH: length 2.2
  Bottom Layer w0.254: U3.7 24.38,7.29 arc(24.51,7.35) C13.1
CPL: length 2.5
  Bottom Layer w0.254: C13.2 24.21,8.53 arc(23.4,7.98) U3.6
CS: length 5.2
  Top Layer w0.254: U2.12 14.96,25.95 arc(15.08,25.34) v1(15.43,24.83)
  Bottom Layer w0.254: v1(15.43,24.83) 16.02,24.83 arc(17.46,24.23) U5.1
D+: length 18
  Top Layer w0.254: U2.34 19.46,16.03 arc(19.17,15.34) v1(18.48,15.05) ; v1(8.43,8.33) 8.94,8.84 USB1.A6 ; 9.72,10.33 v1(10.24,10.84)
  Bottom Layer w0.254: v1(18.48,15.05) arc(18.41,14.69) 18.21,14.4 15.4,11.59 arc(14.57,11.04) 13.6,10.84 11.28,10.84 arc(10.87,11.01) 10.47,10.84 v1(10.24,10.84) arc(10.22,10.75) 10.17,10.67 8.86,9.37 arc(8.54,8.89) v1(8.43,8.33)
D-: length 15.9
  Top Layer w0.254: U2.33 18.96,16.84 arc(18.86,16.33) v1(18.57,15.89) ; v1(10.87,10.42) 10.74,10.29 arc(10.58,10.31) 10.43,10.23 10.25,10.05 arc(10.17,9.99) 10.07,9.97 9.64,9.54 9.03,9.54 8.69,9.2 8.59,9.2
  Bottom Layer w0.254: v1(18.57,15.89) 18.89,15.57 arc(19.05,15.33) 19.11,15.05 19.11,14.85 arc(19.08,14.68) 18.98,14.54 15.61,11.17 arc(14.79,10.62) 13.82,10.42 v1(10.87,10.42)
EN: length 13.1
  Top Layer w0.254: v1(16.82,5.9) 16.68,6.05 arc(16.13,6.87) 15.94,7.84 15.94,13.65 arc(15.8,14.35) 15.4,14.95 15.17,15.17 arc(15.02,15.41) 14.96,15.68 U2.25
  Bottom Layer w0.254: U3.23 17.09,5.79 arc(16.95,5.82) v1(16.82,5.9)
FLT: length 1.8
  Bottom Layer w0.254: U3.22 17.19,5.29 arc(16.99,5.25) v1(16.82,5.14) arc(16.54,5.2) 16.3,5.36 R6.2
INA: length 11.8
  Top Layer w0.254: v1(16.7,7.55) 16.97,7.83 arc(17.52,8.65) 17.71,9.62 17.71,10.06 arc(17.61,10.56) 17.33,10.98 arc(17.15,11.26) 17.08,11.6 17.08,14.25 arc(16.98,14.75) 16.7,15.17 arc(16.52,15.43) 16.46,15.74 U2.28
  Bottom Layer w0.254: v1(16.7,7.55) 16.77,7.63 arc(16.97,7.76) 17.21,7.81 17.6,7.81 arc(17.62,7.8) U3.27
INB: length 10.4
  Top Layer w0.254: U2.27 15.96,15.72 arc(16.02,15.42) 16.19,15.17 arc(16.53,14.67) 16.65,14.07 16.65,11.59 arc(16.73,11.19) 16.95,10.86 arc(17.23,10.43) 17.33,9.94 17.33,9.71 arc(17.28,9.45) 17.13,9.23 v1(16.7,8.8)
  Bottom Layer w0.254: v1(16.7,8.8) 17.62,8.8 arc(17.63,8.8) U3.29
INC: length 9
  Top Layer w0.254: v1(16.7,9.97) 16.7,10.08 arc(16.65,10.35) 16.5,10.57 arc(16.34,10.8) 16.29,11.06 16.29,13.7 arc(16.13,14.5) 15.68,15.17 arc(15.52,15.42) 15.46,15.7 U2.26
  Bottom Layer w0.254: v1(16.7,9.97) arc(16.84,9.87) 17,9.84 17.52,9.84 arc(17.58,9.83) U3.31
MISO: length 4.1
  Top Layer w0.254: v1(19.34,21.33) arc(19.55,21.19) 19.79,21.14 21.94,21.14 arc(21.95,21.15) U2.41
  Bottom Layer w0.254: U5.3 19.35,21.36 arc(19.35,21.34) v1(19.34,21.33)
MODE: length 1.1
  Bottom Layer w0.254: R7.1 18.21,10.97 arc(18.24,10.95) U3.33
MOSI: length 2
  Top Layer w0.254: U2.42 20.2,21.66 arc(20.09,21.68) v1(19.99,21.74)
OUTA: length 2.8
  Bottom Layer w0.762: U7.3 22.92,2.6 arc(21.93,3.01) 21.52,4
OUTB: length 1.4
  Bottom Layer w0.762: U7.2 20.07,4
OUTC: length 2.7
  Bottom Layer w0.762: U7.1 17.08,2.6 arc(18.07,3.01) 18.48,4
RST: length 16.9
  Top Layer w0.254: U2.7 17.46,27.23 arc(17.46,27.24) v1(17.46,27.24) 14.45,27.24 arc(13.48,27.05) 12.65,26.5 11.83,25.67 arc(11.5,25.45) C9.1 arc(10.92,25.24) 10.69,25.2 R5.2 5.55,25.2 arc(4.58,25.01) 3.75,24.45 2.85,23.56
SCK: length 4.1
  Top Layer w0.254: v1(18.7,21.75) 18.7,21.32 arc(18.89,20.85) 19.37,20.66 U2.40
SW_BK: length 4.4
  Bottom Layer w0.254: U3.5 22.72,8.29 arc(23.31,8.54) 23.56,9.12 arc(23.58,9.29) 23.56,9.46 23.56,9.89 arc(23.93,10.79) Lbk.1
VREF: length 1.2
  Bottom Layer w0.254: U3.37 20.29,12.01 arc(20.28,12.05) C14.1

## Copper pours and planes (outline as drawn; the poured copper is in the pictures)
GND on Top Layer: 42.3,20.45 42.26,21.36 42.19,22.26 42.08,23.16 41.93,24.05 41.74,24.94 41.52,25.82 41.26,26.69 40.97,27.55 40.64,28.39 40.27,29.22 39.87,30.03 39.44,30.83 38.98,31.61 38.48,32.37 37.96,33.11 37.4,33.82 36.81,34.51 36.2,35.18 35.56,35.82 34.89,36.43 34.2,37.02 33.49,37.58 32.75,38.1 31.99,38.6 31.21,39.06 30.41,39.49 29.6,39.89 28.77,40.26 27.93,40.58 27.07,40.88 26.2,41.14 25.32,41.36 24.44,41.55 23.54,41.69 22.64,41.81 21.74,41.88 20.83,41.92 19.93,41.92 19.02,41.88 18.12,41.81 17.22,41.69 16.33,41.55 15.44,41.36 14.56,41.14 13.69,40.88 12.84,40.58 11.99,40.26 11.16,39.89 10.35,39.49 9.55,39.06 8.77,38.6 8.01,38.1 7.28,37.58 6.56,37.02 5.87,36.43 5.2,35.82 4.56,35.18 3.95,34.51 3.36,33.82 2.81,33.11 2.28,32.37 1.78,31.61 1.32,30.83 0.89,30.03 0.49,29.22 0.13,28.39 -0.2,27.55 -0.5,26.69 -0.76,25.82 -0.98,24.94 -1.16,24.05 -1.31,23.16 -1.43,22.26 -1.5,21.36 -1.54,20.45 -1.54,19.55 -1.5,18.64 -1.43,17.74 -1.31,16.84 -1.16,15.95 -0.98,15.06 -0.76,14.18 -0.5,13.31 -0.2,12.45 0.13,11.61 0.49,10.78 0.89,9.97 1.32,9.17 1.78,8.39 2.28,7.63 2.81,6.89 3.36,6.18 3.95,5.49 4.56,4.82 5.2,4.18 5.87,3.57 6.56,2.98 7.28,2.42 8.01,1.9 8.77,1.4 9.55,0.94 10.35,0.51 11.16,0.11 11.99,-0.26 12.84,-0.58 13.69,-0.88 14.56,-1.14 15.44,-1.36 16.33,-1.55 17.22,-1.69 18.12,-1.81 19.02,-1.88 19.93,-1.92 20.83,-1.92 21.74,-1.88 22.64,-1.81 23.54,-1.69 24.44,-1.55 25.32,-1.36 26.2,-1.14 27.07,-0.88 27.93,-0.58 28.77,-0.26 29.6,0.11 30.41,0.51 31.21,0.94 31.99,1.4 32.75,1.9 33.49,2.42 34.2,2.98 34.89,3.57 35.56,4.18 36.2,4.82 36.81,5.49 37.4,6.18 37.96,6.89 38.48,7.63 38.98,8.39 39.44,9.17 39.87,9.97 40.27,10.78 40.64,11.61 40.97,12.45 41.26,13.31 41.52,14.18 41.74,15.06 41.93,15.95 42.08,16.84 42.19,17.74 42.26,18.64 42.3,19.55
GND on Bottom Layer: 41.21,20.28 41.17,21.16 41.1,22.03 40.99,22.9 40.84,23.77 40.66,24.62 40.45,25.47 40.2,26.31 39.92,27.14 39.6,27.96 39.24,28.76 38.86,29.55 38.44,30.32 37.99,31.07 37.51,31.81 37.01,32.52 36.47,33.21 35.9,33.88 35.31,34.52 34.69,35.14 34.04,35.74 33.37,36.3 32.68,36.84 31.97,37.35 31.24,37.83 30.48,38.28 29.71,38.7 28.92,39.08 28.12,39.43 27.31,39.75 26.48,40.04 25.64,40.29 24.79,40.5 23.93,40.68 23.06,40.83 22.19,40.93 21.32,41.01 20.45,41.04 19.57,41.04 18.69,41.01 17.82,40.93 16.95,40.83 16.09,40.68 15.23,40.5 14.38,40.29 13.54,40.04 12.71,39.75 11.89,39.43 11.09,39.08 10.3,38.7 9.53,38.28 8.78,37.83 8.05,37.35 7.33,36.84 6.64,36.3 5.97,35.74 5.33,35.14 4.71,34.52 4.11,33.88 3.55,33.21 3.01,32.52 2.5,31.81 2.02,31.07 1.57,30.32 1.16,29.55 0.77,28.76 0.42,27.96 0.1,27.14 -0.18,26.31 -0.43,25.47 -0.65,24.62 -0.83,23.77 -0.97,22.9 -1.08,22.03 -1.15,21.16 -1.19,20.28 -1.19,19.41 -1.15,18.53 -1.08,17.66 -0.97,16.79 -0.83,15.92 -0.65,15.06 -0.43,14.22 -0.18,13.38 0.1,12.55 0.42,11.73 0.77,10.93 1.16,10.14 1.57,9.37 2.02,8.62 2.5,7.88 3.01,7.17 3.55,6.48 4.11,5.81 4.71,5.16 5.33,4.54 5.97,3.95 6.64,3.38 7.33,2.85 8.05,2.34 8.78,1.86 9.53,1.41 10.3,0.99 11.09,0.61 11.89,0.25 12.71,-0.06 13.54,-0.35 14.38,-0.6 15.23,-0.81 16.09,-0.99 16.95,-1.14 17.82,-1.25 18.69,-1.32 19.57,-1.35 20.45,-1.35 21.32,-1.32 22.19,-1.25 23.06,-1.14 23.93,-0.99 24.79,-0.81 25.64,-0.6 26.48,-0.35 27.31,-0.06 28.12,0.25 28.92,0.61 29.71,0.99 30.48,1.41 31.24,1.86 31.97,2.34 32.68,2.85 33.37,3.38 34.04,3.95 34.69,4.54 35.31,5.16 35.9,5.81 36.47,6.48 37.01,7.17 37.51,7.88 37.99,8.62 38.44,9.37 38.86,10.14 39.24,10.93 39.6,11.73 39.92,12.55 40.2,13.38 40.45,14.22 40.66,15.06 40.84,15.92 40.99,16.79 41.1,17.66 41.17,18.53 41.21,19.41

## Text on the board
Top Silkscreen Layer: C | B | A | 120Ω
